# Altium schematic sheet motor.SchDoc
size A4; SheetNumber: 1; SheetTotal: 1
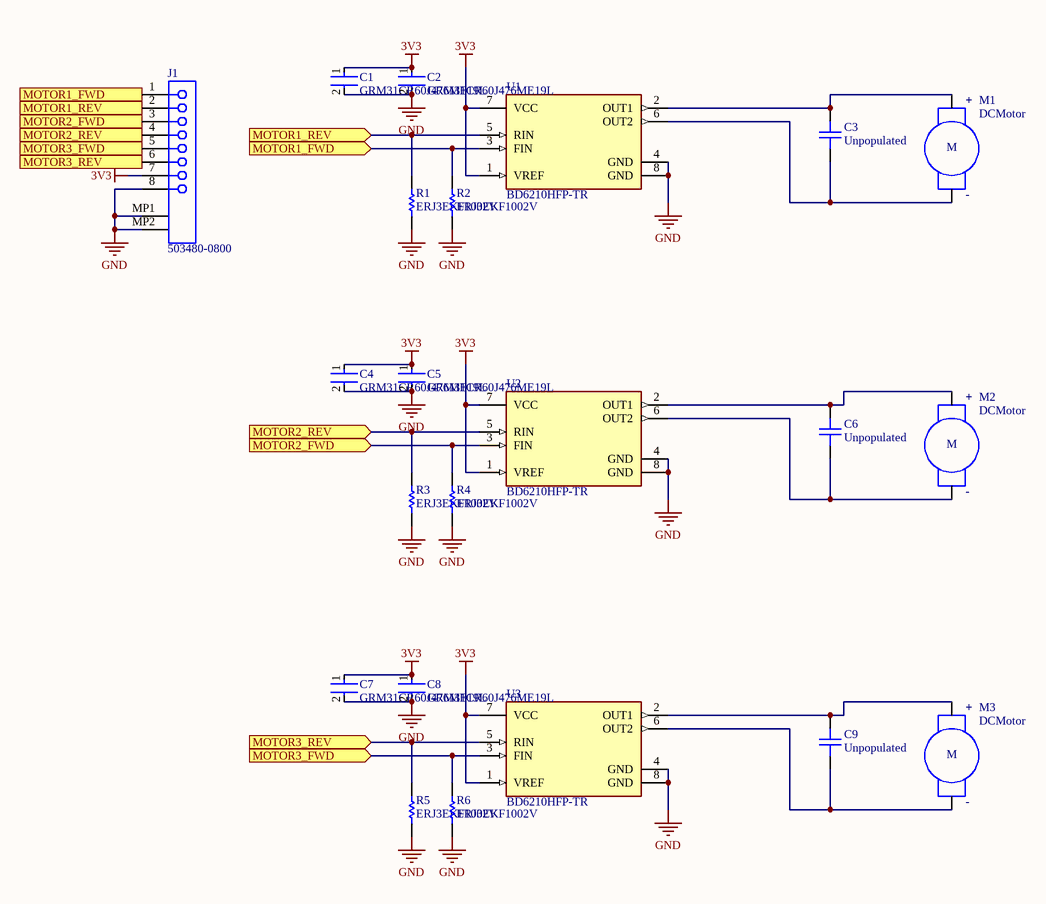
[diagram p0: motor.SchDoc]

## Parts
C1  GRM31CR60J476ME19L  [FP-GRM31C-0_2-e0_3_0_8-IPC_C]
C2  GRM31CR60J476ME19L  [FP-GRM31C-0_2-e0_3_0_8-IPC_C]
C3  Unpopulated  [2012[0805]_M]
C4  GRM31CR60J476ME19L  [FP-GRM31C-0_2-e0_3_0_8-IPC_C]
C5  GRM31CR60J476ME19L  [FP-GRM31C-0_2-e0_3_0_8-IPC_C]
C6  Unpopulated  [2012[0805]_M]
C7  GRM31CR60J476ME19L  [FP-GRM31C-0_2-e0_3_0_8-IPC_C]
C8  GRM31CR60J476ME19L  [FP-GRM31C-0_2-e0_3_0_8-IPC_C]
C9  Unpopulated  [2012[0805]_M]
J1  503480-0800  [MOLX-503480-0800]
M1  DCMotor  [CABLE-TERMINAL1x2]
M2  DCMotor  [CABLE-TERMINAL1x2]
M3  DCMotor  [CABLE-TERMINAL1x2]
R1  ERJ3EKF1002V  [RESC1609X55X30ML15T15]
R2  ERJ3EKF1002V  [RESC1609X55X30ML15T15]
R3  ERJ3EKF1002V  [RESC1609X55X30ML15T15]
R4  ERJ3EKF1002V  [RESC1609X55X30ML15T15]
R5  ERJ3EKF1002V  [RESC1609X55X30ML15T15]
R6  ERJ3EKF1002V  [RESC1609X55X30ML15T15]
U1  BD6210HFP-TR  [FP-HRP7-MFG]
U2  BD6210HFP-TR  [FP-HRP7-MFG]
U3  BD6210HFP-TR  [FP-HRP7-MFG]

## Ports
MOTOR1_FWD (in), MOTOR1_FWD (out), MOTOR1_REV (in), MOTOR1_REV (out), MOTOR2_FWD (in), MOTOR2_FWD (out), MOTOR2_REV (in), MOTOR2_REV (out), MOTOR3_FWD (in), MOTOR3_FWD (out), MOTOR3_REV (in), MOTOR3_REV (out)

## Nets
3V3: C1.1 C2.1 C4.1 C5.1 C7.1 C8.1 J1.7 U1.1(VREF) U1.7(VCC) U2.1(VREF) U2.7(VCC) U3.1(VREF) U3.7(VCC)
GND: C1.2 C2.2 C4.2 C5.2 C7.2 C8.2 J1.8 J1.MP1 J1.MP2 R1.1 R2.1 R3.1 R4.1 R5.1 R6.1 U1.4(GND) U1.8(GND) U2.4(GND) U2.8(GND) U3.4(GND) U3.8(GND)
MOTOR1_FWD: J1.1 R2.2 U1.3(FIN) ; port MOTOR1_FWD
MOTOR1_REV: J1.2 R1.2 U1.5(RIN) ; port MOTOR1_REV
MOTOR2_FWD: J1.3 R4.2 U2.3(FIN) ; port MOTOR2_FWD
MOTOR2_REV: J1.4 R3.2 U2.5(RIN) ; port MOTOR2_REV
MOTOR3_FWD: J1.5 R6.2 U3.3(FIN) ; port MOTOR3_FWD
MOTOR3_REV: J1.6 R5.2 U3.5(RIN) ; port MOTOR3_REV
NetC3_1: C3.1 M1.- U1.6(OUT2)
NetC3_2: C3.2 M1.+ U1.2(OUT1)
NetC6_1: C6.1 M2.- U2.6(OUT2)
NetC6_2: C6.2 M2.+ U2.2(OUT1)
NetC9_1: C9.1 M3.- U3.6(OUT2)
NetC9_2: C9.2 M3.+ U3.2(OUT1)

## Notes on the sheet
- (in symbol CMP-034-000000-1) M

## Library data of the parts
C1 C2 C4 C5 C7 C8 = CMP-2000-06344-2: Chip Multilayer Ceramic Capacitors for General Purpose, 1206, 47uF, X5R, 15%, 20%, 6.3V; Package Quantity: 2000; Mount: Surface Mount; Length: 3.2mm; Thickness: 0.071inch; Lead Free: Lead Free; Tolerance: 20%; Width: 0.063inch; Depth: 1.6mm; Case/Package: 1206; Dielectric: X5R; Radiation Hardening: No; Packaging: Tape and Reel; Voltage Rating (DC): 6.3V; Termination: SMD/SMT; Height: 1.6mm; Max Operating Temperature: 85°C; Case Code (Metric): 3216; Case Code (Imperial): 1206; Voltage: 6.3V; Voltage Rating: 6.3V; Capacitance: 47uF; Min Operating Temperature: -55°C; Material: Ceramic; REACH SVHC: No SVHC
C3 C6 C9 = Capacitor: Generic Capacitor; Value: Unpopulated
J1 = CMP-1241-00114-1: 0.5 mm Pitch Easy-On(TM) BackFlip(TM) Type FPC Connector, 1.0 mm Mated Height, Right Angle, SMT, Dual Contact, 8 Circuits, -40 to 85 degC, ELV and RoHS Compliant, Tape and Reel; Manufacturer: Molex; Mated Height: 1.00mm; Circuits (Loaded): 8; Entry Angle: 90degrees Angle; Material - Plating Termination: Gold, Tin; Material - Plating Mating: Gold; Stackable: No; Pitch - Mating Interface: 0.50mm; Durability (mating cycles max): 10; Voltage (Max): 50V AC (RMS)/DC; Polarized to PCB: Yes; Current (Max per Contact): 0.5A; Material - Metal: Phosphor Bronze; PackageVersion: Rev. F, 09/2012; Mounting Technology: Surface Mount; ComponentLink1Description: Manufacturer URL; PartNumber: 503480-0800; ComponentLink3URL: http://www.molex.com/pdm_docs/sd/5034800800_sd.pdf; ComponentLink2URL: http://www.molex.com/webdocs/datasheets/pdf/en-us/5034800800_FFC_FPC_CONNECTORS.pdf; Orientation: Right Angle; ComponentLink1URL: http://www.molex.com/molex/index.jsp; PackageDescription: 8-Lead FPC Connector, Pitch 0.5 mm; ComponentLink3Description: Package Specification; RoHS: TRUE; Contact Position: Dual; Number of Rows: 1; ComponentLink2Description: Datasheet; PCB Locator: No; PCB Retention: Yes; Packing: Tape and Reel; PackageReference: 503480-0800
M1-M3 = CMP-034-000000-1: Generic DC motor; Source: Motor.SchLib; Design Item ID: DCMotor
R1-R6 = CMP-1012-00623-3: Chip Resistor, 10 KOhm, +/- 1%, 0.1 W, -55 to 155 degC, 0603 (1608 Metric), RoHS, Tape and Reel; Manufacturer: Panasonic; Voltage Rating: 75V; Case\/Package: 0603; Power Rating: 100mW; Resistance: 10KOhm; Temperature Coefficient: 100ppm\/degreesC; Number of Pins: 2; Package Reference: 603; Depth: 0.8mm; Mount: SurfaceMount; Package Description: 2-Pin Surface Mount Device, Body 1.6 x 0.85 mm; Datasheet Version: 02/2017; Length: 1.6mm; Lead Free: LeadFree; Height: 0.45mm; Number of Terminations: 2; Max Power Dissipation: 100mW; Min Operating Temperature: -55degC; Datasheet URL: https://industrial.panasonic.com/cdbs/www-data/pdf/RDA0000/AOA0000C304.pdf; Termination: SMD/SMT; Case Code (Metric): 1608; Case Code (Imperial): 0603; Tolerance: 1%; Max Operating Temperature: 155degC; RoHSCompliant: true; Voltage Rating (DC): 75V; Radiation Hardening: No; Packaging: TapeandReel; Composition: ThickFilm; Mounting Technology: SurfaceMount; Manufacturer URL: http://www.panasonic.com/; Width: 0.031inch; REACH SVHC: NoSVHC; Contact Plating: Tin; Military Standard: Not; Package Quantity: 1
U1-U3 = CMP-08935-000017-1: IC MOTOR DRIVER 3V-5.5V HRP7; Interface: On/Off; Nominal Supply Current: 1.5mA; Logic Function: AND GATE; Number of Outputs: 1; Max Supply Voltage: 5.5V; Output Current: 500mA; Number of Pins: 8; RoHS Compliant: Yes; Package Quantity: 2000; Max Operating Temperature: 85°C; Min Operating Temperature: -40°C; Lead Free: Lead Free; Radiation Hardening: No; Mount: Surface Mount; Packaging: Tape and Reel; Supply Current: 1.5mA; Case/Package: TO-263-8